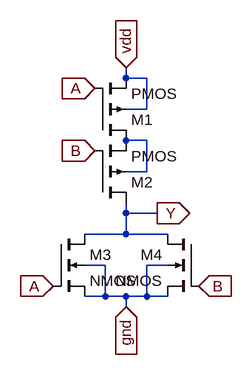
[diagram p0: schematic nor.asc]
nor.asc, the LTspice schematic file:
Version 4
SHEET 1 880 680
WIRE 192 -32 192 -48
WIRE 224 -32 192 -32
WIRE 224 16 224 -32
WIRE 224 16 192 16
WIRE 224 64 192 64
WIRE 224 112 224 64
WIRE 224 112 192 112
WIRE 192 176 192 160
WIRE 240 176 192 176
WIRE 192 208 192 176
WIRE 192 208 128 208
WIRE 256 208 192 208
WIRE 160 256 128 256
WIRE 256 256 224 256
WIRE 160 304 160 256
WIRE 160 304 128 304
WIRE 192 304 160 304
WIRE 224 304 224 256
WIRE 224 304 192 304
WIRE 256 304 224 304
WIRE 192 320 192 304
FLAG 192 -48 vdd
IOPIN 192 -48 In
FLAG 144 -16 A
IOPIN 144 -16 In
FLAG 80 288 A
IOPIN 80 288 In
FLAG 144 80 B
IOPIN 144 80 In
FLAG 304 288 B
IOPIN 304 288 In
FLAG 240 176 Y
IOPIN 240 176 Out
FLAG 192 320 gnd
IOPIN 192 320 In
SYMBOL pmos4 144 64 M180
WINDOW 0 56 32 Left 0
WINDOW 3 56 72 Left 0
SYMATTR InstName M1
SYMBOL pmos4 144 160 M180
WINDOW 0 56 32 Left 0
WINDOW 3 56 72 Left 0
SYMATTR InstName M2
SYMBOL nmos4 80 208 R0
WINDOW 0 56 32 Left 0
WINDOW 3 56 72 Left 0
SYMATTR InstName M3
SYMBOL nmos4 304 208 M0
WINDOW 0 56 32 Left 0
WINDOW 3 56 72 Left 0
SYMATTR InstName M4

The netlist it stands for:
* nor.asc
M1 N001 A vdd vdd PMOS
M2 Y B N001 N001 PMOS
M3 Y A gnd gnd NMOS
M4 Y B gnd gnd NMOS
.model NMOS NMOS
.model PMOS PMOS
.lib standard.mos
.backanno
.end